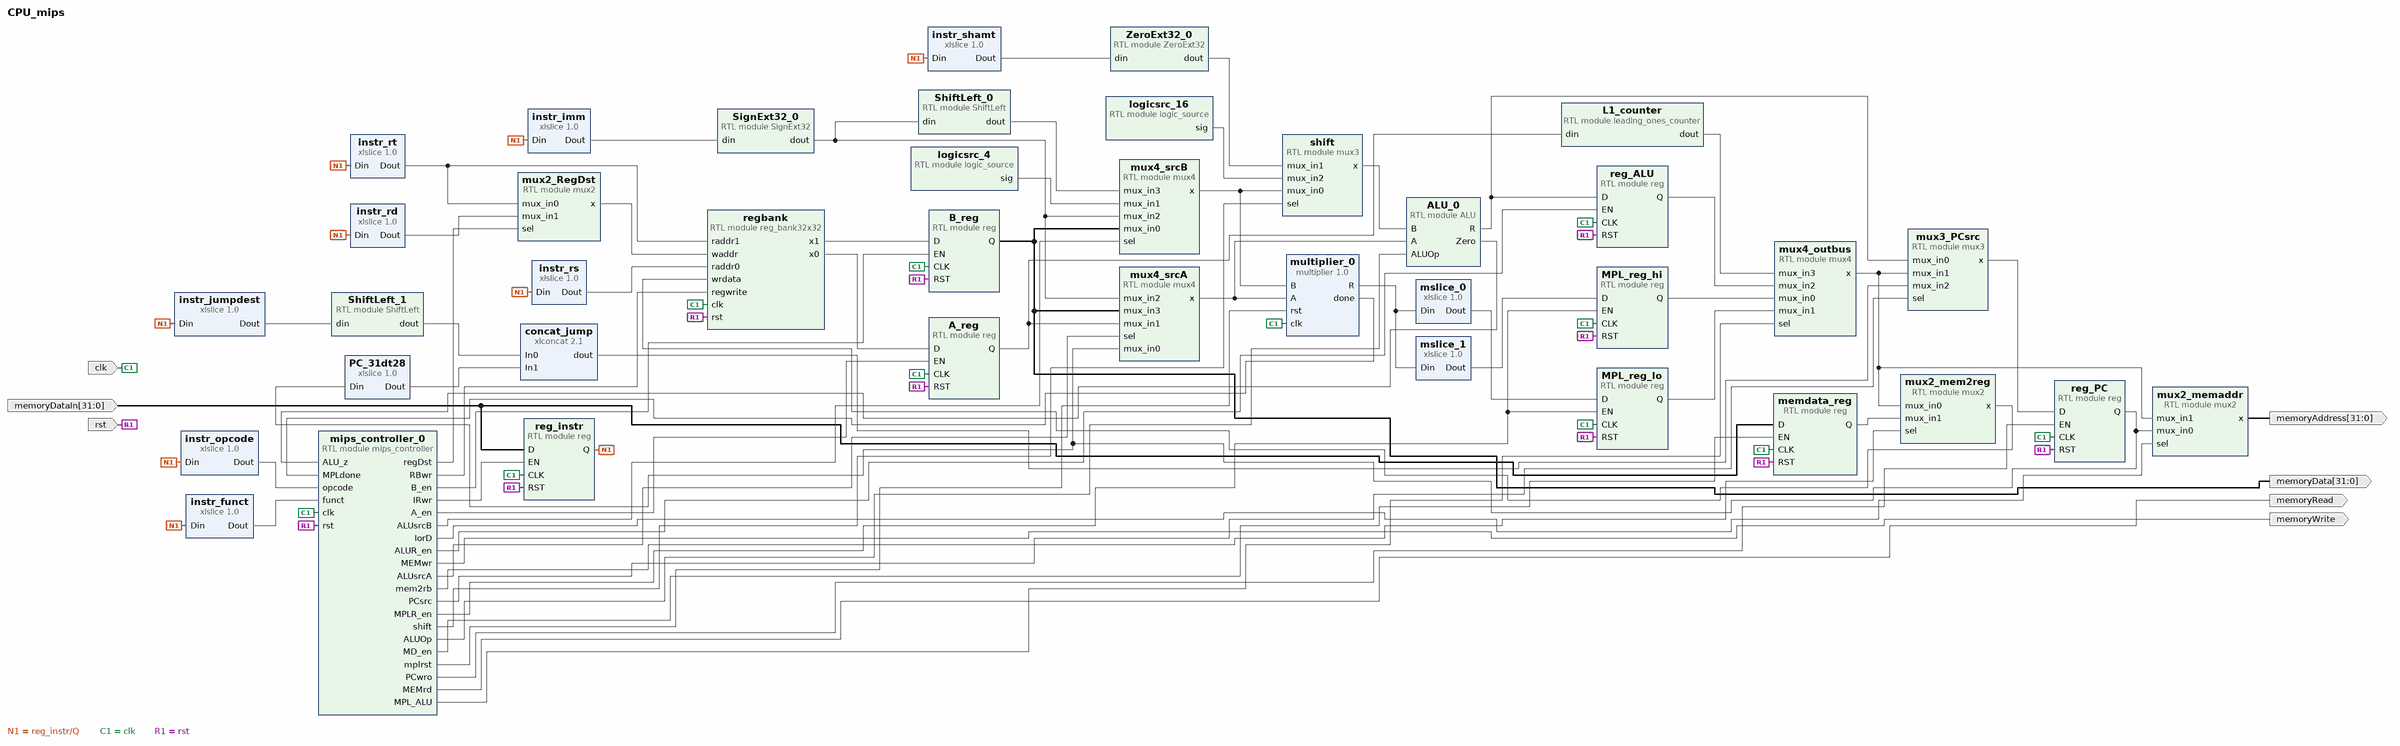
[diagram p0: block diagram of the top level]
# Vivado block design CPU_mips, xc7z020clg400-1, Vivado 2018.3
create_bd_design CPU_mips

create_bd_port -dir I -from 31 -to 0 memoryDataIn
create_bd_port -dir I -type clk clk
create_bd_port -dir O -from 31 -to 0 memoryAddress
create_bd_port -dir I -type rst rst
create_bd_port -dir O -from 31 -to 0 memoryData
create_bd_port -dir O memoryWrite
create_bd_port -dir O memoryRead

create_bd_cell -type ip -vlnv xilinx.com:ip:xlslice:1.0 instr_jumpdest
set_property -dict {CONFIG.DIN_FROM 25 CONFIG.DIN_TO 0 CONFIG.DOUT_WIDTH 26} [get_bd_cells instr_jumpdest]
create_bd_cell -type ip -vlnv xilinx.com:ip:xlslice:1.0 instr_rs
set_property -dict {CONFIG.DIN_FROM 25 CONFIG.DIN_TO 21 CONFIG.DOUT_WIDTH 5} [get_bd_cells instr_rs]
create_bd_cell -type ip -vlnv xilinx.com:ip:xlslice:1.0 instr_rt
set_property -dict {CONFIG.DIN_FROM 20 CONFIG.DIN_TO 16 CONFIG.DOUT_WIDTH 5} [get_bd_cells instr_rt]
create_bd_cell -type ip -vlnv xilinx.com:ip:xlslice:1.0 instr_rd
set_property -dict {CONFIG.DIN_FROM 15 CONFIG.DIN_TO 11 CONFIG.DOUT_WIDTH 5} [get_bd_cells instr_rd]
create_bd_cell -type ip -vlnv xilinx.com:ip:xlslice:1.0 instr_funct
set_property -dict {CONFIG.DIN_FROM 5 CONFIG.DIN_TO 0 CONFIG.DOUT_WIDTH 6} [get_bd_cells instr_funct]
create_bd_cell -type ip -vlnv xilinx.com:ip:xlslice:1.0 instr_imm
set_property -dict {CONFIG.DIN_FROM 15 CONFIG.DIN_TO 0 CONFIG.DOUT_WIDTH 16} [get_bd_cells instr_imm]
create_bd_cell -type ip -vlnv xilinx.com:ip:xlslice:1.0 instr_opcode
set_property -dict {CONFIG.DIN_FROM 31 CONFIG.DIN_TO 26 CONFIG.DOUT_WIDTH 6} [get_bd_cells instr_opcode]
create_bd_cell -type ip -vlnv xilinx.com:ip:xlslice:1.0 instr_shamt
set_property -dict {CONFIG.DIN_FROM 10 CONFIG.DIN_TO 6 CONFIG.DOUT_WIDTH 5} [get_bd_cells instr_shamt]
create_bd_cell -type module -reference mux3 mux3_PCsrc
create_bd_cell -type ip -vlnv xilinx.com:ip:xlslice:1.0 PC_31dt28
set_property -dict {CONFIG.DIN_FROM 31 CONFIG.DIN_TO 28 CONFIG.DOUT_WIDTH 4} [get_bd_cells PC_31dt28]
create_bd_cell -type ip -vlnv xilinx.com:ip:xlconcat:2.1 concat_jump
set_property -dict {CONFIG.IN0_WIDTH 28 CONFIG.IN1_WIDTH 4} [get_bd_cells concat_jump]
create_bd_cell -type ip -vlnv xilinx.com:user:multiplier:1.0 multiplier_0
create_bd_cell -type module -reference mux2 mux2_mem2reg
set_property -dict {CONFIG.n 32} [get_bd_cells mux2_mem2reg]
create_bd_cell -type module -reference mux2 mux2_RegDst
set_property -dict {CONFIG.n 5} [get_bd_cells mux2_RegDst]
create_bd_cell -type module -reference mux4 mux4_srcB
create_bd_cell -type module -reference mux2 mux2_memaddr
set_property -dict {CONFIG.n 32} [get_bd_cells mux2_memaddr]
create_bd_cell -type ip -vlnv xilinx.com:ip:xlslice:1.0 mslice_0
set_property -dict {CONFIG.DIN_FROM 31 CONFIG.DIN_TO 0 CONFIG.DIN_WIDTH 64 CONFIG.DOUT_WIDTH 32} [get_bd_cells mslice_0]
create_bd_cell -type ip -vlnv xilinx.com:ip:xlslice:1.0 mslice_1
set_property -dict {CONFIG.DIN_FROM 63 CONFIG.DIN_TO 32 CONFIG.DIN_WIDTH 64 CONFIG.DOUT_WIDTH 1} [get_bd_cells mslice_1]
create_bd_cell -type module -reference reg MPL_reg_lo
set_property -dict {CONFIG.n 32} [get_bd_cells MPL_reg_lo]
create_bd_cell -type module -reference reg memdata_reg
set_property -dict {CONFIG.n 32} [get_bd_cells memdata_reg]
create_bd_cell -type module -reference reg B_reg
set_property -dict {CONFIG.n 32} [get_bd_cells B_reg]
create_bd_cell -type module -reference reg A_reg
set_property -dict {CONFIG.n 32} [get_bd_cells A_reg]
create_bd_cell -type module -reference reg reg_instr
set_property -dict {CONFIG.n 32} [get_bd_cells reg_instr]
create_bd_cell -type module -reference reg reg_ALU
set_property -dict {CONFIG.n 32} [get_bd_cells reg_ALU]
create_bd_cell -type module -reference reg MPL_reg_hi
set_property -dict {CONFIG.n 32} [get_bd_cells MPL_reg_hi]
create_bd_cell -type module -reference reg reg_PC
set_property -dict {CONFIG.n 32} [get_bd_cells reg_PC]
create_bd_cell -type module -reference reg_bank32x32 regbank
create_bd_cell -type module -reference mux4 mux4_srcA
create_bd_cell -type module -reference ALU ALU_0
create_bd_cell -type module -reference mux3 shift
create_bd_cell -type module -reference mux4 mux4_outbus
create_bd_cell -type module -reference ShiftLeft ShiftLeft_0
create_bd_cell -type module -reference ShiftLeft ShiftLeft_1
set_property -dict {CONFIG.n_in 26 CONFIG.n_out 28} [get_bd_cells ShiftLeft_1]
create_bd_cell -type module -reference SignExt32 SignExt32_0
set_property -dict {CONFIG.n_in 16} [get_bd_cells SignExt32_0]
create_bd_cell -type module -reference ZeroExt32 ZeroExt32_0
set_property -dict {CONFIG.n_in 5} [get_bd_cells ZeroExt32_0]
create_bd_cell -type module -reference leading_ones_counter L1_counter
create_bd_cell -type module -reference logic_source logicsrc_4
set_property -dict {CONFIG.value 4} [get_bd_cells logicsrc_4]
create_bd_cell -type module -reference logic_source logicsrc_16
set_property -dict {CONFIG.value 16} [get_bd_cells logicsrc_16]
create_bd_cell -type module -reference mips_controller mips_controller_0

# ---- connections ----

connect_bd_net -net bank_wraddr [get_bd_pins mux2_RegDst/x] [get_bd_pins regbank/waddr]
connect_bd_net -net bank_wrdata [get_bd_pins mux2_mem2reg/x] [get_bd_pins regbank/wrdata]
connect_bd_net -net MDR_out [get_bd_pins memdata_reg/Q] [get_bd_pins mux2_mem2reg/mux_in1]
connect_bd_net -net IR_out [get_bd_pins reg_instr/Q] \
  [get_bd_pins instr_jumpdest/Din] [get_bd_pins instr_rs/Din] [get_bd_pins instr_rt/Din] [get_bd_pins instr_rd/Din] \
  [get_bd_pins instr_funct/Din] [get_bd_pins instr_imm/Din] [get_bd_pins instr_opcode/Din] [get_bd_pins instr_shamt/Din]
connect_bd_net -net IR_rd [get_bd_pins instr_rd/Dout] [get_bd_pins mux2_RegDst/mux_in1]
connect_bd_net -net IR_rt [get_bd_pins instr_rt/Dout] [get_bd_pins mux2_RegDst/mux_in0] [get_bd_pins regbank/raddr1]
connect_bd_net -net bank_B [get_bd_pins regbank/x1] [get_bd_pins B_reg/D]
connect_bd_net -net bank_A [get_bd_pins regbank/x0] [get_bd_pins A_reg/D]
connect_bd_net -net imm_32 [get_bd_pins SignExt32_0/dout] \
  [get_bd_pins mux4_srcB/mux_in2] [get_bd_pins mux4_srcA/mux_in2] [get_bd_pins ShiftLeft_0/din]
connect_bd_net -net imm_sl2 [get_bd_pins ShiftLeft_0/dout] [get_bd_pins mux4_srcB/mux_in3]
connect_bd_net -net IR_imm_16 [get_bd_pins instr_imm/Dout] [get_bd_pins SignExt32_0/din]
connect_bd_net -net srcA [get_bd_pins mux4_srcA/x] [get_bd_pins multiplier_0/A] [get_bd_pins ALU_0/A]
connect_bd_net -net srcB [get_bd_pins mux4_srcB/x] [get_bd_pins multiplier_0/B] [get_bd_pins shift/mux_in0]
connect_bd_net -net ALU_result [get_bd_pins ALU_0/R] [get_bd_pins mux3_PCsrc/mux_in0] [get_bd_pins reg_ALU/D]
connect_bd_net -net IR_jump [get_bd_pins instr_jumpdest/Dout] [get_bd_pins ShiftLeft_1/din]
connect_bd_net -net memdata_in [get_bd_ports memoryDataIn] [get_bd_pins memdata_reg/D] [get_bd_pins reg_instr/D]
connect_bd_net [get_bd_ports clk] \
  [get_bd_pins multiplier_0/clk] [get_bd_pins MPL_reg_lo/CLK] [get_bd_pins memdata_reg/CLK] [get_bd_pins B_reg/CLK] \
  [get_bd_pins A_reg/CLK] [get_bd_pins reg_instr/CLK] [get_bd_pins reg_ALU/CLK] [get_bd_pins MPL_reg_hi/CLK] \
  [get_bd_pins reg_PC/CLK] [get_bd_pins regbank/clk] [get_bd_pins mips_controller_0/clk]
connect_bd_net -net PC_in [get_bd_pins mux3_PCsrc/x] [get_bd_pins reg_PC/D]
connect_bd_net -net PC_out [get_bd_pins reg_PC/Q] [get_bd_pins PC_31dt28/Din] [get_bd_pins mux2_memaddr/mux_in0] [get_bd_pins mux4_srcA/mux_in0]
connect_bd_net [get_bd_pins mux2_memaddr/x] [get_bd_ports memoryAddress]
connect_bd_net [get_bd_ports rst] \
  [get_bd_pins MPL_reg_lo/RST] [get_bd_pins memdata_reg/RST] [get_bd_pins B_reg/RST] [get_bd_pins A_reg/RST] \
  [get_bd_pins reg_instr/RST] [get_bd_pins reg_ALU/RST] [get_bd_pins MPL_reg_hi/RST] [get_bd_pins reg_PC/RST] \
  [get_bd_pins regbank/rst] [get_bd_pins mips_controller_0/rst]
connect_bd_net -net B_out [get_bd_pins B_reg/Q] [get_bd_ports memoryData] [get_bd_pins mux4_srcB/mux_in0] [get_bd_pins mux4_srcA/mux_in3]
connect_bd_net -net IR_rs [get_bd_pins instr_rs/Dout] [get_bd_pins regbank/raddr0]
connect_bd_net -net IR_jump_SL2 [get_bd_pins ShiftLeft_1/dout] [get_bd_pins concat_jump/In0]
connect_bd_net -net PC_4msb [get_bd_pins PC_31dt28/Dout] [get_bd_pins concat_jump/In1]
connect_bd_net -net jump_dest [get_bd_pins concat_jump/dout] [get_bd_pins mux3_PCsrc/mux_in2]
connect_bd_net -net ALU_Zero [get_bd_pins ALU_0/Zero] [get_bd_pins mips_controller_0/ALU_z]
connect_bd_net -net IR_opcode [get_bd_pins instr_opcode/Dout] [get_bd_pins mips_controller_0/opcode]
connect_bd_net -net instr_OR_data [get_bd_pins mips_controller_0/IorD] [get_bd_pins mux2_memaddr/sel]
connect_bd_net -net mem_write [get_bd_pins mips_controller_0/MEMwr] [get_bd_ports memoryWrite]
connect_bd_net -net mem2reg [get_bd_pins mips_controller_0/mem2rb] [get_bd_pins mux2_mem2reg/sel]
connect_bd_net -net IR_write [get_bd_pins mips_controller_0/IRwr] [get_bd_pins reg_instr/EN]
connect_bd_net -net RegDst [get_bd_pins mips_controller_0/regDst] [get_bd_pins mux2_RegDst/sel]
connect_bd_net -net bank_write [get_bd_pins mips_controller_0/RBwr] [get_bd_pins regbank/regwrite]
connect_bd_net -net ALUsrcB_sel [get_bd_pins mips_controller_0/ALUsrcB] [get_bd_pins mux4_srcB/sel]
connect_bd_net -net PCsrc_sel [get_bd_pins mips_controller_0/PCsrc] [get_bd_pins mux3_PCsrc/sel]
connect_bd_net -net A_write [get_bd_pins mips_controller_0/A_en] [get_bd_pins A_reg/EN]
connect_bd_net -net B_write [get_bd_pins mips_controller_0/B_en] [get_bd_pins B_reg/EN]
connect_bd_net -net ALUOut_write [get_bd_pins mips_controller_0/ALUR_en] [get_bd_pins reg_ALU/EN]
connect_bd_net -net memdata_write [get_bd_pins mips_controller_0/MD_en] [get_bd_pins memdata_reg/EN]
connect_bd_net -net MPL_done [get_bd_pins multiplier_0/done] [get_bd_pins mips_controller_0/MPLdone]
connect_bd_net -net MPL_rslt_64 [get_bd_pins multiplier_0/R] [get_bd_pins mslice_0/Din] [get_bd_pins mslice_1/Din]
connect_bd_net -net data_bus [get_bd_pins mux4_outbus/x] \
  [get_bd_pins mux3_PCsrc/mux_in1] [get_bd_pins mux2_memaddr/mux_in1] [get_bd_pins mux2_mem2reg/mux_in0]
connect_bd_net -net MPLOut_write [get_bd_pins mips_controller_0/MPLR_en] [get_bd_pins MPL_reg_lo/EN] [get_bd_pins MPL_reg_hi/EN]
connect_bd_net -net PC_write [get_bd_pins mips_controller_0/PCwro] [get_bd_pins reg_PC/EN]
connect_bd_net -net Lsrc4 [get_bd_pins logicsrc_4/sig] [get_bd_pins mux4_srcB/mux_in1]
connect_bd_net -net A_out [get_bd_pins A_reg/Q] [get_bd_pins mux4_srcA/mux_in1] [get_bd_pins L1_counter/din]
connect_bd_net -net ALUsrcA_sel [get_bd_pins mips_controller_0/ALUsrcA] [get_bd_pins mux4_srcA/sel]
connect_bd_net -net mem_read [get_bd_pins mips_controller_0/MEMrd] [get_bd_ports memoryRead]
connect_bd_net -net ALUOp [get_bd_pins mips_controller_0/ALUOp] [get_bd_pins ALU_0/ALUOp]
connect_bd_net -net IR_funct [get_bd_pins instr_funct/Dout] [get_bd_pins mips_controller_0/funct]
connect_bd_net -net IR_shamt [get_bd_pins instr_shamt/Dout] [get_bd_pins ZeroExt32_0/din]
connect_bd_net [get_bd_pins shift/x] [get_bd_pins ALU_0/B]
connect_bd_net [get_bd_pins ZeroExt32_0/dout] [get_bd_pins shift/mux_in1]
connect_bd_net -net logicsrc_5_sig [get_bd_pins logicsrc_16/sig] [get_bd_pins shift/mux_in2]
connect_bd_net [get_bd_pins mips_controller_0/shift] [get_bd_pins shift/sel]
connect_bd_net [get_bd_pins mips_controller_0/mplrst] [get_bd_pins multiplier_0/rst]
connect_bd_net [get_bd_pins mslice_1/Dout] [get_bd_pins MPL_reg_hi/D]
connect_bd_net [get_bd_pins mslice_0/Dout] [get_bd_pins MPL_reg_lo/D]
connect_bd_net [get_bd_pins MPL_reg_hi/Q] [get_bd_pins mux4_outbus/mux_in0]
connect_bd_net [get_bd_pins MPL_reg_lo/Q] [get_bd_pins mux4_outbus/mux_in1]
connect_bd_net [get_bd_pins reg_ALU/Q] [get_bd_pins mux4_outbus/mux_in2]
connect_bd_net [get_bd_pins mips_controller_0/MPL_ALU] [get_bd_pins mux4_outbus/sel]
connect_bd_net -net leading_ones_counter_0_dout [get_bd_pins L1_counter/dout] [get_bd_pins mux4_outbus/mux_in3]

validate_bd_design
save_bd_design
